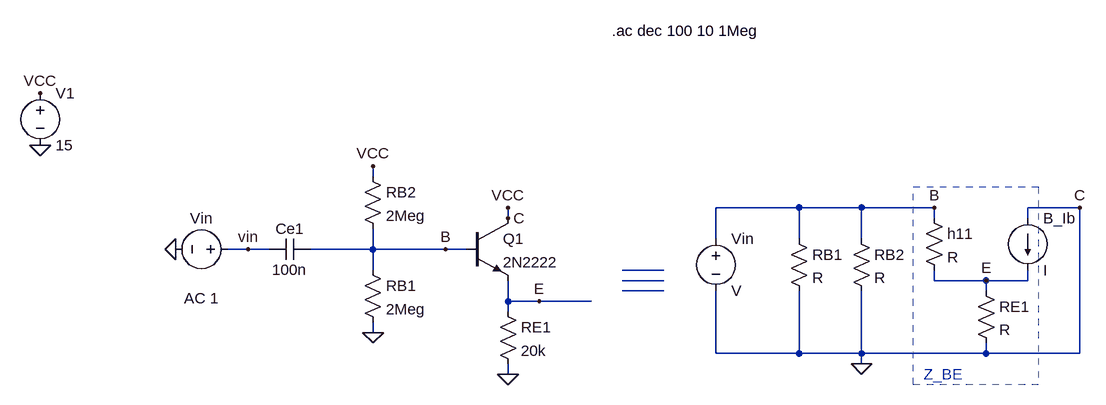
[diagram p0: schematic Emmitter_Follower_Test.asc]
Emmitter_Follower_Test.asc, the LTspice schematic file:
Version 4
SHEET 1 1272 680
WIRE 160 48 160 32
WIRE 816 96 688 96
WIRE 912 96 816 96
WIRE 1024 96 912 96
WIRE 1248 96 1168 96
WIRE 368 112 368 96
WIRE 1024 112 1024 96
WIRE 1168 112 1168 96
WIRE 688 144 688 96
WIRE 816 144 816 96
WIRE 912 144 912 96
WIRE -32 160 -64 160
WIRE 0 160 -32 160
WIRE 160 160 160 128
WIRE 160 160 64 160
WIRE 272 160 160 160
WIRE 304 160 272 160
WIRE 160 192 160 160
WIRE 608 192 544 192
WIRE 608 208 544 208
WIRE 1024 208 1024 192
WIRE 1104 208 1024 208
WIRE 1168 208 1168 192
WIRE 1168 208 1104 208
WIRE 608 224 544 224
WIRE 1104 224 1104 208
WIRE 368 240 368 208
WIRE 416 240 368 240
WIRE 496 240 416 240
WIRE 368 256 368 240
WIRE 160 288 160 272
WIRE 688 320 688 224
WIRE 816 320 816 224
WIRE 816 320 688 320
WIRE 912 320 912 224
WIRE 912 320 816 320
WIRE 1104 320 1104 304
WIRE 1104 320 912 320
WIRE 1248 320 1248 96
WIRE 1248 320 1104 320
WIRE 912 336 912 320
WIRE 368 352 368 336
FLAG 160 288 0
FLAG 160 32 VCC
FLAG 368 96 VCC
FLAG 368 352 0
FLAG -144 160 0
FLAG -352 0 0
FLAG -352 -80 VCC
FLAG -32 160 vin
FLAG 272 160 B
FLAG 368 112 C
FLAG 416 240 E
FLAG 912 336 0
FLAG 1104 208 E
FLAG 1024 96 B
FLAG 1248 96 C
SYMBOL res 144 176 R0
SYMATTR InstName RB1
SYMATTR Value 2Meg
SYMBOL res 144 32 R0
SYMATTR InstName RB2
SYMATTR Value 2Meg
SYMBOL res 352 240 R0
SYMATTR InstName RE1
SYMATTR Value 20k
SYMBOL npn 304 112 R0
SYMATTR InstName Q1
SYMATTR Value 2N2222
SYMBOL cap 64 144 R90
WINDOW 0 0 32 VBottom 2
WINDOW 3 32 32 VTop 2
SYMATTR InstName Ce1
SYMATTR Value 100n
SYMBOL voltage -352 -96 R0
SYMATTR InstName V1
SYMATTR Value 15
SYMBOL voltage -48 160 R90
WINDOW 0 -32 56 VBottom 2
WINDOW 3 32 56 VTop 2
WINDOW 123 60 56 VTop 2
WINDOW 39 0 0 Left 0
SYMATTR InstName Vin
SYMATTR Value ""
SYMATTR Value2 AC 1
SYMBOL voltage 688 128 R0
SYMATTR InstName Vin
SYMBOL res 896 128 R0
SYMATTR InstName RB2
SYMBOL res 800 128 R0
SYMATTR InstName RB1
SYMBOL res 1008 96 R0
SYMATTR InstName h11
SYMBOL res 1088 208 R0
SYMATTR InstName RE1
SYMBOL current 1168 112 R0
SYMATTR InstName B_Ib
TEXT 528 -176 Left 2 !.ac dec 100 10 1Meg
TEXT 1008 352 Left 2 ;Z_BE
RECTANGLE Normal 1184 368 992 64 2

The netlist it stands for:
* Emmitter_Follower_Test.asc
RB1 B 0 2Meg
RB2 0 B 2Meg
RE1 E 0 20k
Q1 0 B E 0 2N2222
Ce1 B vin 100n
V1 0 0 15
Vin vin 0 AC 1
Vin B 0 V
RB2 B 0 R
RB1 B 0 R
R§h11 B E R
RE1 E 0 R
I§B_Ib 0 E I
.model NPN NPN
.model PNP PNP
.lib standard.bjt
.ac dec 100 10 1Meg
* Z_BE
.backanno
.end